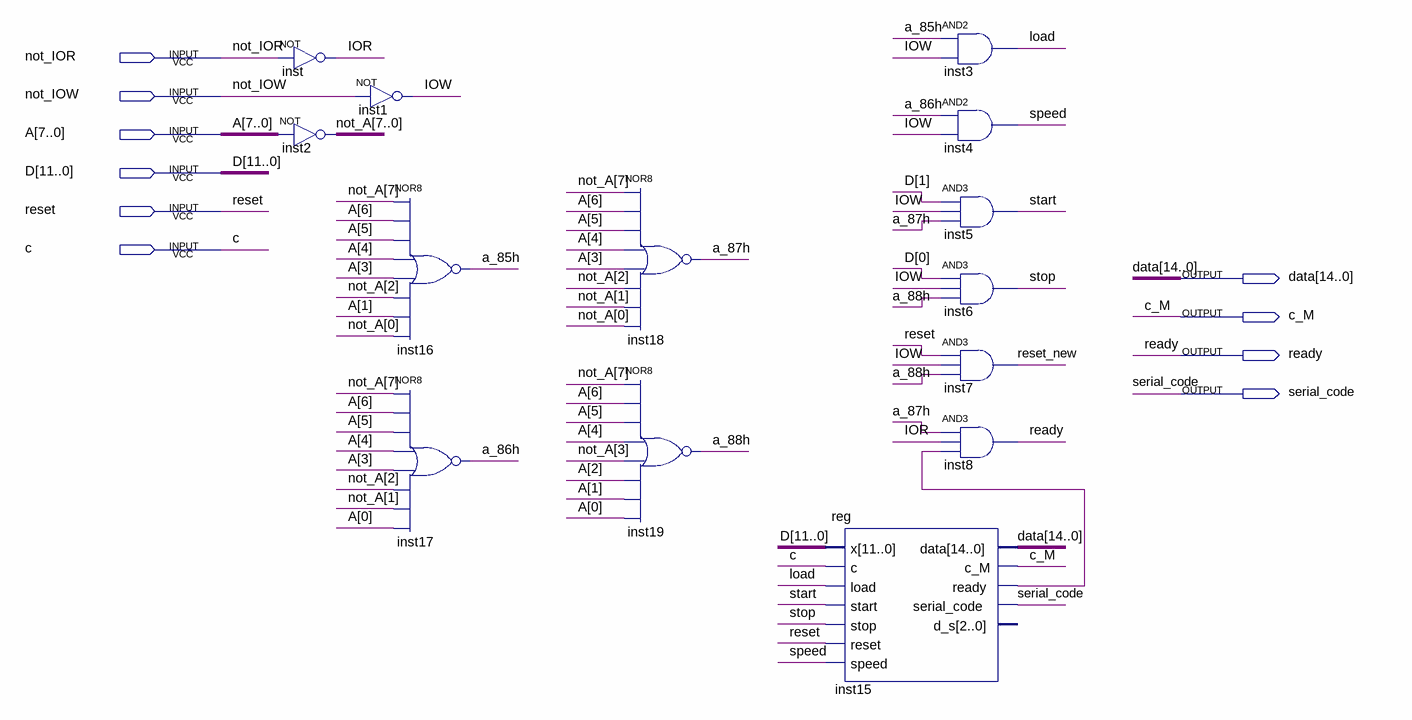
[diagram p0: schematic sheet]
// Quartus schematic proc.bdf as structural Verilog: 14 symbols, 10 pins
module proc (
  input  not_IOR,
  input  not_IOW,
  input  [7:0] A,
  input  [11:0] D,
  input  reset,
  input  c,
  output [14:0] data,
  output c_M,
  output ready,
  output serial_code
);

  wire a_85h, a_86h, a_87h, a_88h, inst15_ready, IOR, IOW, load, reset_new, speed, start, stop;
  wire [7:0] not_A;

  not inst (IOR, not_IOR);
  assign not_A = ~A;  // NOT inst2, 8 bits wide
  not inst1 (IOW, not_IOW);
  nor inst16 (a_85h, not_A[7], A[6], A[5], A[4], A[3], not_A[2], A[1], not_A[0]);
  nor inst17 (a_86h, not_A[7], A[6], A[5], A[4], A[3], not_A[2], not_A[1], A[0]);
  nor inst18 (a_87h, not_A[7], A[6], A[5], A[4], A[3], not_A[2], not_A[1], not_A[0]);
  nor inst19 (a_88h, not_A[7], A[6], A[5], A[4], not_A[3], A[2], A[1], A[0]);
  \reg  inst15 (
    .x(D), .c(c), .load(load), .start(start), .stop(stop), .reset(reset), .speed(speed), .data(data),
    .c_M(c_M), .ready(inst15_ready), .serial_code(serial_code));  // open: d_s
  and inst3 (load, a_85h, IOW);
  and inst4 (speed, a_86h, IOW);
  and inst5 (start, D[1], IOW, a_87h);
  and inst6 (stop, D[0], IOW, a_88h);
  and inst7 (reset_new, reset, IOW, a_88h);
  and inst8 (ready, a_87h, IOR, inst15_ready);
endmodule
